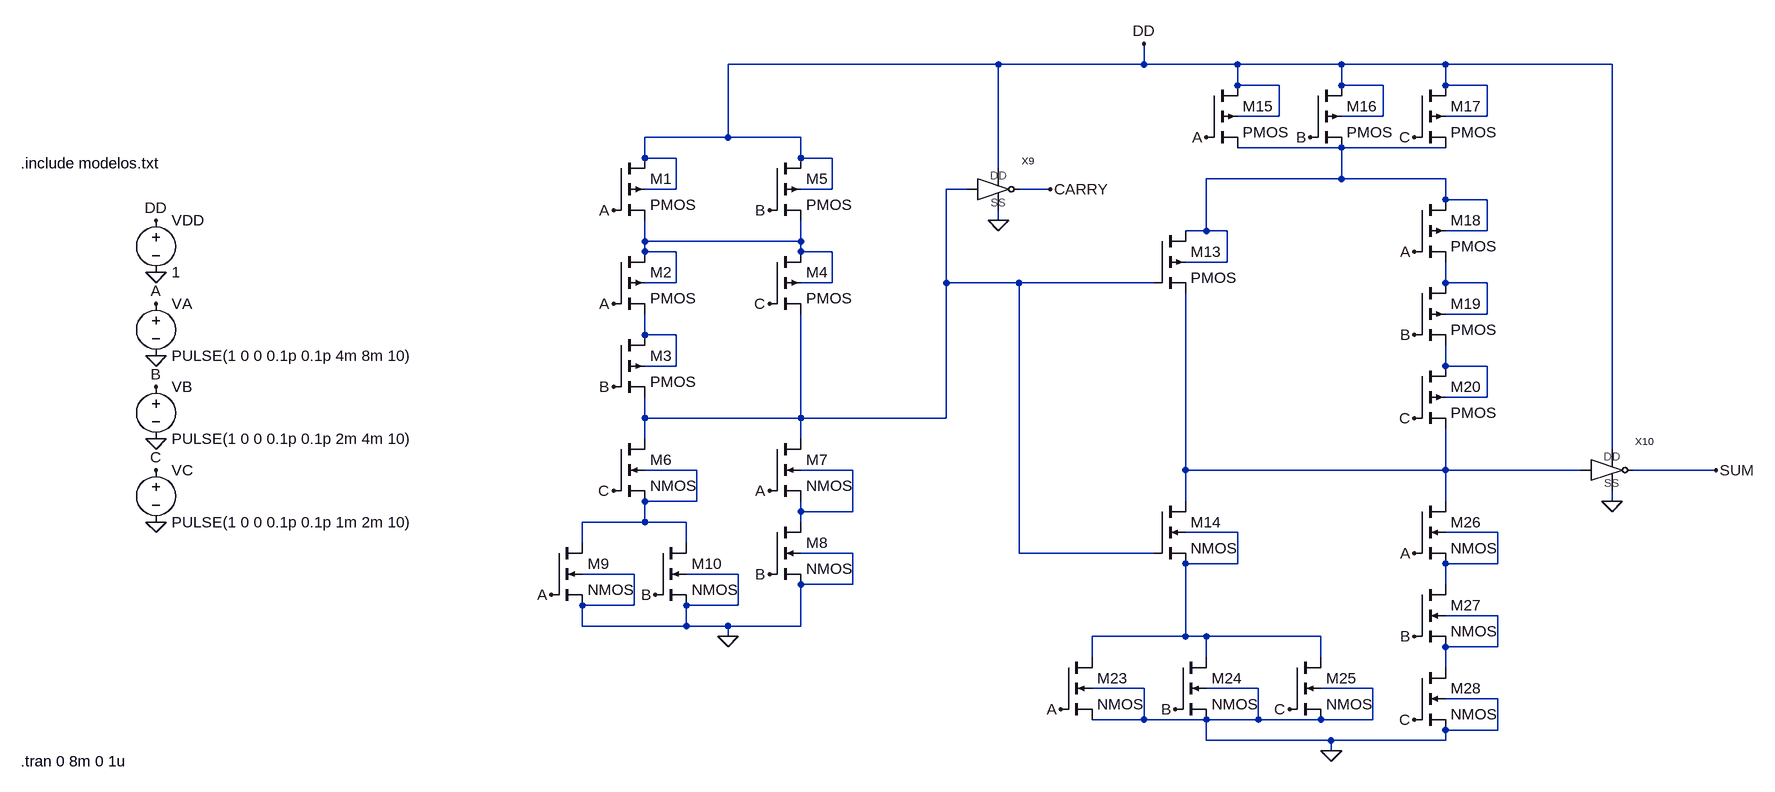
[diagram p0: schematic 1.asc]
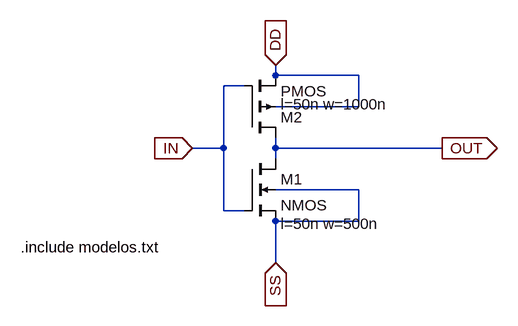
[diagram p1: sub-circuit simb_inv.asc]
1.asc, the LTspice schematic file:
Version 4
SHEET 1 3300 896
WIRE 1216 -192 800 -192
WIRE 1440 -192 1440 -224
WIRE 1440 -192 1216 -192
WIRE 1584 -192 1440 -192
WIRE 1744 -192 1584 -192
WIRE 1904 -192 1744 -192
WIRE 2160 -192 1904 -192
WIRE 1584 -160 1584 -192
WIRE 1648 -160 1584 -160
WIRE 1744 -160 1744 -192
WIRE 1808 -160 1744 -160
WIRE 1904 -160 1904 -192
WIRE 1968 -160 1904 -160
WIRE 1648 -112 1648 -160
WIRE 1648 -112 1584 -112
WIRE 1808 -112 1808 -160
WIRE 1808 -112 1744 -112
WIRE 1968 -112 1968 -160
WIRE 1968 -112 1904 -112
WIRE 800 -80 800 -192
WIRE 800 -80 672 -80
WIRE 912 -80 800 -80
WIRE 1744 -64 1584 -64
WIRE 1904 -64 1744 -64
WIRE 672 -48 672 -80
WIRE 720 -48 672 -48
WIRE 912 -48 912 -80
WIRE 960 -48 912 -48
WIRE 1216 -32 1216 -192
WIRE 1744 -16 1744 -64
WIRE 1744 -16 1536 -16
WIRE 1904 -16 1744 -16
WIRE 720 0 720 -48
WIRE 720 0 672 0
WIRE 960 0 960 -48
WIRE 960 0 912 0
WIRE 1168 0 1136 0
WIRE 1296 0 1248 0
WIRE 1904 16 1904 -16
WIRE 1968 16 1904 16
WIRE 1216 48 1216 32
WIRE 1536 64 1536 -16
WIRE 1536 64 1504 64
WIRE 1568 64 1536 64
WIRE 1968 64 1968 16
WIRE 1968 64 1904 64
WIRE 672 80 672 48
WIRE 912 80 912 48
WIRE 912 80 672 80
WIRE 672 96 672 80
WIRE 720 96 672 96
WIRE 912 96 912 80
WIRE 960 96 912 96
WIRE 1568 112 1568 64
WIRE 1568 112 1504 112
WIRE 720 144 720 96
WIRE 720 144 672 144
WIRE 960 144 960 96
WIRE 960 144 912 144
WIRE 1136 144 1136 0
WIRE 1248 144 1136 144
WIRE 1456 144 1248 144
WIRE 1904 144 1904 112
WIRE 1968 144 1904 144
WIRE 1968 192 1968 144
WIRE 1968 192 1904 192
WIRE 672 224 672 192
WIRE 720 224 672 224
WIRE 720 272 720 224
WIRE 720 272 672 272
WIRE 1904 272 1904 240
WIRE 1968 272 1904 272
WIRE 1968 320 1968 272
WIRE 1968 320 1904 320
WIRE 672 352 672 320
WIRE 912 352 912 192
WIRE 912 352 672 352
WIRE 1136 352 1136 144
WIRE 1136 352 912 352
WIRE 672 384 672 352
WIRE 912 384 912 352
WIRE 2160 400 2160 -192
WIRE 752 432 672 432
WIRE 992 432 912 432
WIRE 1504 432 1504 160
WIRE 1904 432 1904 368
WIRE 1904 432 1504 432
WIRE 2112 432 1904 432
WIRE 2320 432 2192 432
WIRE 752 480 752 432
WIRE 752 480 672 480
WIRE 1504 480 1504 432
WIRE 1904 480 1904 432
WIRE 2160 480 2160 464
WIRE 912 496 912 480
WIRE 992 496 992 432
WIRE 992 496 912 496
WIRE 672 512 672 480
WIRE 672 512 576 512
WIRE 736 512 672 512
WIRE 912 512 912 496
WIRE 1584 528 1504 528
WIRE 1984 528 1904 528
WIRE 576 544 576 512
WIRE 736 544 736 512
WIRE 992 560 912 560
WIRE 1248 560 1248 144
WIRE 1456 560 1248 560
WIRE 1584 576 1584 528
WIRE 1584 576 1504 576
WIRE 1984 576 1984 528
WIRE 1984 576 1904 576
WIRE 656 592 576 592
WIRE 816 592 736 592
WIRE 992 608 992 560
WIRE 992 608 912 608
WIRE 1904 608 1904 576
WIRE 656 640 656 592
WIRE 656 640 576 640
WIRE 816 640 816 592
WIRE 816 640 736 640
WIRE 1984 656 1904 656
WIRE 576 672 576 640
WIRE 736 672 736 640
WIRE 736 672 576 672
WIRE 800 672 736 672
WIRE 912 672 912 608
WIRE 912 672 800 672
WIRE 800 688 800 672
WIRE 1504 688 1504 576
WIRE 1504 688 1360 688
WIRE 1536 688 1504 688
WIRE 1712 688 1536 688
WIRE 1984 704 1984 656
WIRE 1984 704 1904 704
WIRE 1360 720 1360 688
WIRE 1536 720 1536 688
WIRE 1712 720 1712 688
WIRE 1904 736 1904 704
WIRE 1440 768 1360 768
WIRE 1616 768 1536 768
WIRE 1792 768 1712 768
WIRE 1984 784 1904 784
WIRE 1440 816 1440 768
WIRE 1440 816 1360 816
WIRE 1536 816 1440 816
WIRE 1616 816 1616 768
WIRE 1616 816 1536 816
WIRE 1712 816 1616 816
WIRE 1792 816 1792 768
WIRE 1792 816 1712 816
WIRE 1984 832 1984 784
WIRE 1984 832 1904 832
WIRE 1536 848 1536 816
WIRE 1728 848 1536 848
WIRE 1904 848 1904 832
WIRE 1904 848 1728 848
WIRE 1728 864 1728 848
FLAG -80 512 0
FLAG -80 384 0
FLAG -80 256 0
FLAG -80 128 0
FLAG -80 48 DD
FLAG -80 176 A
FLAG -80 304 B
FLAG -80 432 C
FLAG 624 32 A
FLAG 624 176 A
FLAG 624 304 B
FLAG 864 176 C
FLAG 864 32 B
FLAG 800 688 0
FLAG 528 624 A
FLAG 864 464 A
FLAG 864 592 B
FLAG 688 624 B
FLAG 624 464 C
FLAG 1296 0 CARRY
FLAG 1536 -80 A
FLAG 1696 -80 B
FLAG 1856 -80 C
FLAG 1856 96 A
FLAG 1856 224 B
FLAG 1856 352 C
FLAG 1440 -224 DD
FLAG 2320 432 SUM
FLAG 1312 800 A
FLAG 1488 800 B
FLAG 1664 800 C
FLAG 1856 560 A
FLAG 1856 688 B
FLAG 1856 816 C
FLAG 1216 48 0
FLAG 2160 480 0
FLAG 1728 864 0
SYMBOL voltage -80 32 R0
SYMATTR InstName VDD
SYMATTR Value 1
SYMBOL voltage -80 160 R0
WINDOW 123 0 0 Left 2
WINDOW 39 0 0 Left 2
SYMATTR InstName VA
SYMATTR Value PULSE(1 0 0 0.1p 0.1p 4m 8m 10)
SYMBOL voltage -80 288 R0
WINDOW 123 0 0 Left 2
WINDOW 39 0 0 Left 2
SYMATTR InstName VB
SYMATTR Value PULSE(1 0 0 0.1p 0.1p 2m 4m 10)
SYMBOL voltage -80 416 R0
WINDOW 123 0 0 Left 2
WINDOW 39 0 0 Left 2
SYMATTR InstName VC
SYMATTR Value PULSE(1 0 0 0.1p 0.1p 1m 2m 10)
SYMBOL pmos4 624 -48 R0
SYMATTR InstName M1
SYMATTR Value2 l=50n w=3000n
SYMBOL pmos4 624 96 R0
SYMATTR InstName M2
SYMATTR Value2 l=50n w=3000n
SYMBOL pmos4 624 224 R0
SYMATTR InstName M3
SYMATTR Value2 l=50n w=3000n
SYMBOL pmos4 864 96 R0
SYMATTR InstName M4
SYMATTR Value2 l=50n w=1500n
SYMBOL pmos4 864 -48 R0
SYMATTR InstName M5
SYMATTR Value2 l=50n w=3000n
SYMBOL nmos4 624 384 R0
SYMATTR InstName M6
SYMATTR Value2 l=50n w=1000n
SYMBOL nmos4 864 384 R0
SYMATTR InstName M7
SYMATTR Value2 l=50n w=1000n
SYMBOL nmos4 864 512 R0
SYMATTR InstName M8
SYMATTR Value2 l=50n w=1000n
SYMBOL nmos4 528 544 R0
SYMATTR InstName M9
SYMATTR Value2 l=50n w=1000n
SYMBOL nmos4 688 544 R0
SYMATTR InstName M10
SYMATTR Value2 l=50n w=1000n
SYMBOL pmos4 1456 64 R0
SYMATTR InstName M13
SYMATTR Value2 l=50n w=1500n
SYMBOL nmos4 1456 480 R0
SYMATTR InstName M14
SYMATTR Value2 l=50n w=1000n
SYMBOL pmos4 1536 -160 R0
SYMATTR InstName M15
SYMATTR Value2 l=50n w=4000n
SYMBOL pmos4 1696 -160 R0
SYMATTR InstName M16
SYMATTR Value2 l=50n w=4000n
SYMBOL pmos4 1856 -160 R0
SYMATTR InstName M17
SYMATTR Value2 l=50n w=4000n
SYMBOL pmos4 1856 16 R0
SYMATTR InstName M18
SYMATTR Value2 l=50n w=4000n
SYMBOL pmos4 1856 144 R0
SYMATTR InstName M19
SYMATTR Value2 l=50n w=4000n
SYMBOL pmos4 1856 272 R0
SYMATTR InstName M20
SYMATTR Value2 l=50n w=4000n
SYMBOL nmos4 1312 720 R0
SYMATTR InstName M23
SYMATTR Value2 l=50n w=1000n
SYMBOL nmos4 1488 720 R0
SYMATTR InstName M24
SYMATTR Value2 l=50n w=1000n
SYMBOL nmos4 1664 720 R0
SYMATTR InstName M25
SYMATTR Value2 l=50n w=1000n
SYMBOL nmos4 1856 480 R0
SYMATTR InstName M26
SYMATTR Value2 l=50n w=1500n
SYMBOL nmos4 1856 608 R0
SYMATTR InstName M27
SYMATTR Value2 l=50n w=1500n
SYMBOL nmos4 1856 736 R0
SYMATTR InstName M28
SYMATTR Value2 l=50n w=1500n
SYMBOL simb_inv 1216 0 R0
SYMATTR InstName X9
SYMBOL simb_inv 2160 432 R0
SYMATTR InstName X10
TEXT -288 -40 Left 2 !.include modelos.txt
TEXT -288 880 Left 2 !.tran 0 8m 0 1u

simb_inv.asc, the sub-circuit schematic file:
Version 4
SHEET 1 880 680
WIRE 176 32 176 16
WIRE 304 32 176 32
WIRE 128 48 96 48
WIRE 304 80 304 32
WIRE 304 80 176 80
WIRE 96 144 96 48
WIRE 96 144 48 144
WIRE 176 144 176 128
WIRE 432 144 176 144
WIRE 176 160 176 144
WIRE 304 208 176 208
WIRE 96 240 96 144
WIRE 128 240 96 240
WIRE 304 256 304 208
WIRE 304 256 176 256
WIRE 176 320 176 256
FLAG 176 16 DD
IOPIN 176 16 In
FLAG 48 144 IN
IOPIN 48 144 In
FLAG 176 320 SS
IOPIN 176 320 In
FLAG 432 144 OUT
IOPIN 432 144 Out
SYMBOL nmos4 128 160 R0
WINDOW 123 56 100 Left 2
SYMATTR Value2 l=50n w=500n
SYMATTR InstName M1
SYMBOL pmos4 128 128 M180
WINDOW 123 56 52 Left 2
SYMATTR Value2 l=50n w=1000n
SYMATTR InstName M2
TEXT -216 296 Left 2 !.include modelos.txt

The netlist it stands for:
* 1.asc
VDD DD 0 1
VA A 0 PULSE(1 0 0 0.1p 0.1p 4m 8m 10)
VB B 0 PULSE(1 0 0 0.1p 0.1p 2m 4m 10)
VC C 0 PULSE(1 0 0 0.1p 0.1p 1m 2m 10)
M1 DD A N003 DD PMOS l=50n w=3000n
M2 N003 A N005 N003 PMOS l=50n w=3000n
M3 N005 B N002 N005 PMOS l=50n w=3000n
M4 N003 C N002 N003 PMOS l=50n w=1500n
M5 DD B N003 DD PMOS l=50n w=3000n
M6 N002 C N007 N007 NMOS l=50n w=1000n
M7 N002 A N008 N008 NMOS l=50n w=1000n
M8 N008 B 0 0 NMOS l=50n w=1000n
M9 N007 A 0 0 NMOS l=50n w=1000n
M10 N007 B 0 0 NMOS l=50n w=1000n
M13 N001 N002 N009 N001 PMOS l=50n w=1500n
M14 N009 N002 N010 N010 NMOS l=50n w=1000n
M15 DD A N001 DD PMOS l=50n w=4000n
M16 DD B N001 DD PMOS l=50n w=4000n
M17 DD C N001 DD PMOS l=50n w=4000n
M18 N001 A N004 N001 PMOS l=50n w=4000n
M19 N004 B N006 N004 PMOS l=50n w=4000n
M20 N006 C N009 N006 PMOS l=50n w=4000n
M23 N010 A 0 0 NMOS l=50n w=1000n
M24 N010 B 0 0 NMOS l=50n w=1000n
M25 N010 C 0 0 NMOS l=50n w=1000n
M26 N009 A N011 N011 NMOS l=50n w=1500n
M27 N011 B N012 N012 NMOS l=50n w=1500n
M28 N012 C 0 0 NMOS l=50n w=1500n
XX9 N002 CARRY DD 0 simb_inv
XX10 N009 SUM DD 0 simb_inv

* block symbol definitions
.subckt simb_inv IN OUT DD SS
M1 OUT IN SS SS NMOS l=50n w=500n
M2 OUT IN DD DD PMOS l=50n w=1000n
.include modelos.txt
.ends simb_inv

.model NMOS NMOS
.model PMOS PMOS
.lib standard.mos
.include modelos.txt
.tran 0 8m 0 1u
.backanno
.end